# Altium schematic sheet LHC_Power.SchDoc
size A
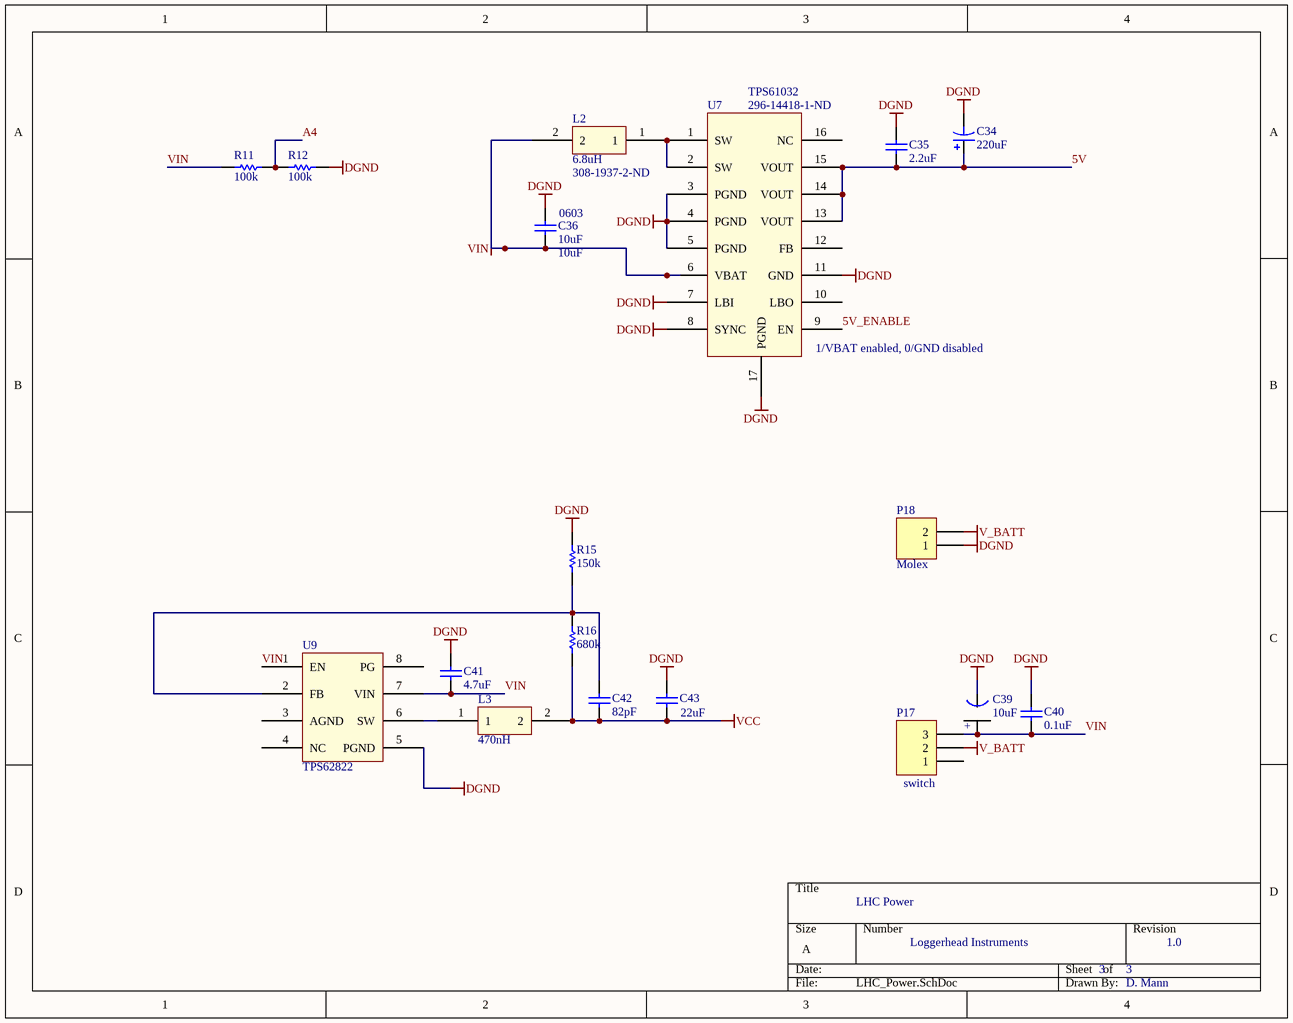
[diagram p0: LHC_Power.SchDoc]

## Parts
C34  220uF  [X]
C35  2.2uF  [0402]
C36  10uF  [0603]
C39  10uF  [Tant0805]
C40  0.1uF  [0402]
C41  4.7uF  [0603]
C42  82pF  [0402]
C43  22uF  [0603]
L2  6.8uH  Supplier Part Number 1: 308-1937-2-ND  [Inductor - duplicate]
L3  470nH  [Inductor_470NH]
P17  switch  [HDR1X3]
P18  Molex  [HDR1X2]
R11  100k  [3-0603]
R12  100k  [3-0603]
R15  150k  [3-0603]
R16  680k  [3-0603]
U7  TPS61032  Supplier Part Number 2: 296-14418-1-ND  [TPS6103x]
U9  TPS62822  [TPS62822_SOP8]

## Nets
DGND: C34.2 C35.2 C36.1 C39.1(GND) C40.2 C41.1 C43.1 P18.1 R12.1 R15.2 U7.3(PGND) U7.4(PGND) U7.5(PGND) U7.7(LBI) U7.8(SYNC) U7.11(GND) U7.17(PGND) U9.5(PGND)
V_BATT: P17.2 P18.2
VCC: C42.1 C43.2 L3.2 R16.1
VIN: C36.2 C39.2(+) C40.1 C41.2 L2.2 P17.3 R11.2 U7.6(VBAT) U9.1(EN) U9.7(VIN)
5V: C34.1 C35.1 U7.13(VOUT) U7.14(VOUT) U7.15(VOUT)
5V_ENABLE: U7.9(EN)
A4: R11.1 R12.2
NetC42_2: C42.2 R15.1 R16.2 U9.2(FB)
NetL2_1: L2.1 U7.1(SW) U7.2(SW)
NetL3_1: L3.1 U9.6(SW)

Not connected (* = marked no-connect by the designer): P17 1; U7 10(LBO) 12(FB) 16(NC); U9 3(AGND) 4(NC) 8(PG)

## Notes on the sheet
- (near U7) 1/VBAT enabled, 0/GND disabled
- LHC Power
- Loggerhead Instruments
- 3
- 1.0
- D. Mann

## Library data of the parts
C34 = T495X: Solid Tantalum Chip Capacitor, Standard T495 Series - Low ESR, Surge Robust; PCB_Layout: Round Glue Pad at 2.9 ±0.1mm in diameter at KEMET's option; Published: 17-Jul-2002; LatestRevisionDate: 19-Mar-2004; LatestRevisionNote: Silkscreen dimensions re-sized.; DatasheetDocument: Mar-2001; PackageDocument: Mar-2001; PackageReference: X; Publisher: Altium Limited; Code_JEITA: 7343-43; ComponentLink1Description: Manufacturer Link; ComponentLink1URL: http://www.kemet.com/; ComponentLink2Description: Datasheet; ComponentLink2URL: http://www.kemet.com/kemet/web/homepage/kechome.nsf/vapubfilesname/F3102TA.pdf/$file/F3102TA.pdf; Value: 220uF
C35 C40 = C0402: Ceramic Chip Capacitor - Standard; Note: Footprint corresponds to dimensions for bulk cassette packaging. This case size has tightened tolerances.; Published: 17-Jul-2002; LatestRevisionDate: 19-Mar-2004; LatestRevisionNote: Silkscreen size reduced.; DatasheetDocument: Mar-2001; PackageDocument: Mar-2001; PackageReference: 0402; Publisher: Altium Limited; Code_JEITA: 0402; Code_IPC: 1005 [0402]; ComponentLink1Description: Manufacturer Link; ComponentLink1URL: http://www.kemet.com/; ComponentLink2Description: Datasheet; ComponentLink2URL: http://www.kemet.com/kemet/web/homepage/kechome.nsf/vapubfilesname/F3102TA.pdf/$file/F3102TA.pdf
  C35: Value: 2.2uF
  C40: Value: 0.1uF
C36 = C0603: Ceramic Chip Capacitor - 0603; Note: Footprint corresponds to dimensions for bulk cassette packaging. This case size has tightened tolerances.; Published: 17-Jul-2002; LatestRevisionDate: 19-Mar-2004; LatestRevisionNote: Silkscreen size reduced.; DatasheetDocument: Mar-2001; PackageDocument: Mar-2001; PackageReference: 0603; Publisher: Altium Limited; Code_JEITA: 0603; Code_IPC: 1608 [0603]; ComponentLink1Description: Manufacturer Link; ComponentLink1URL: http://www.kemet.com/; ComponentLink2Description: Datasheet; ComponentLink2URL: http://www.kemet.com/kemet/web/homepage/kechome.nsf/vapubfilesname/F3102TA.pdf/$file/F3102TA.pdf; Value: 10uF
C39 = Tant0805: Value: 10uF
C41 = C0603: Ceramic Chip Capacitor - Standard; Note: Footprint corresponds to dimensions for bulk cassette packaging. This case size has tightened tolerances.; Published: 17-Jul-2002; LatestRevisionDate: 19-Mar-2004; LatestRevisionNote: Silkscreen size reduced.; DatasheetDocument: Mar-2001; PackageDocument: Mar-2001; PackageReference: 0603; Publisher: Altium Limited; Code_JEITA: 0603; Code_IPC: 1608 [0603]; ComponentLink1Description: Manufacturer Link; ComponentLink1URL: http://www.kemet.com/; ComponentLink2Description: Datasheet; ComponentLink2URL: http://www.kemet.com/kemet/web/homepage/kechome.nsf/vapubfilesname/F3102TA.pdf/$file/F3102TA.pdf; Value: 4.7uF
C42 = C0402: Ceramic Chip Capacitor - Standard; Note: Footprint corresponds to dimensions for bulk cassette packaging. This case size has tightened tolerances.; Value: 0.1uF; Published: 17-Jul-2002; LatestRevisionDate: 19-Mar-2004; LatestRevisionNote: Silkscreen size reduced.; DatasheetDocument: Mar-2001; PackageDocument: Mar-2001; PackageReference: 0402; Publisher: Altium Limited; Code_JEITA: 0402; Code_IPC: 1005 [0402]; ComponentLink1Description: Manufacturer Link; ComponentLink1URL: http://www.kemet.com/; ComponentLink2Description: Datasheet; ComponentLink2URL: http://www.kemet.com/kemet/web/homepage/kechome.nsf/vapubfilesname/F3102TA.pdf/$file/F3102TA.pdf
C43 = C0603: Ceramic Chip Capacitor - Standard; Note: Footprint corresponds to dimensions for bulk cassette packaging. This case size has tightened tolerances.; Value: 4.7uF; Published: 17-Jul-2002; LatestRevisionDate: 19-Mar-2004; LatestRevisionNote: Silkscreen size reduced.; DatasheetDocument: Mar-2001; PackageDocument: Mar-2001; PackageReference: 0603; Publisher: Altium Limited; Code_JEITA: 0603; Code_IPC: 1608 [0603]; ComponentLink1Description: Manufacturer Link; ComponentLink1URL: http://www.kemet.com/; ComponentLink2Description: Datasheet; ComponentLink2URL: http://www.kemet.com/kemet/web/homepage/kechome.nsf/vapubfilesname/F3102TA.pdf/$file/F3102TA.pdf
L2 = Inductor 6.8uH: Sumida Inductor; Supplier 1: Digi-Key
L3 = Inductor_470NH: Supplier 1: Newark; Supplier Part Number 1: 27T2304
P17 = Header 3: Header, 3-Pin; LatestRevisionDate: 17-Jul-2002; LatestRevisionNote: Re-released for DXP Platform.; Publisher: Altium Limited
P18 = Header 2: Header, 2-Pin; LatestRevisionDate: 17-Jul-2002; LatestRevisionNote: Re-released for DXP Platform.; Publisher: Altium Limited
R11 R12 R15 R16 = ERJ3RK: Precision Thick Film Chip Resistor, 10 Ohm to 1M Ohm Range, 1% and 0.5% Tolerance, 0603 Size, 0.063 W; Published: 17-Dec-2003; LatestRevisionDate: 19-Mar-2004; LatestRevisionNote: Silkscreen size reduced.; PackageDocument: Mar-2003; PackageReference: 3-0603; Publisher: Altium Limited; Code_IPC: 1608 [0603]; ComponentLink1Description: Manufacturer Link; ComponentLink1URL: http://www.panasonic.com/industrial/components/resistive_products.htm; ComponentLink2Description: Datasheet; ComponentLink2URL: http://www.panasonic.com/industrial/components/pdf/AOA0000CE2.pdf
U7 = TPS6103x: Boost converter; Supplier 1: Newark; Supplier 2: Digi-Key
U9 = TPS62822: Step-down converter; Supplier 1: Farnell; Supplier Part Number 1: 2894176